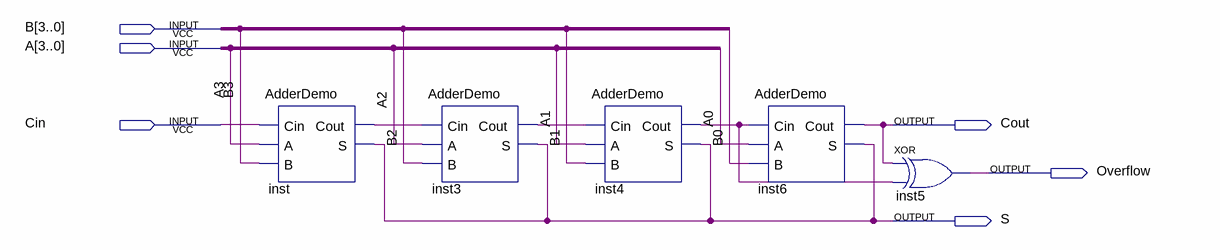
[diagram p0: schematic sheet]
// Quartus schematic Adder.bdf as structural Verilog: 5 symbols, 6 pins
module Adder (
  input  [3:0] B,
  input  [3:0] A,
  input  Cin,
  output Cout,
  output Overflow,
  output S
);

  wire inst3_cout, inst4_cout, inst_cout;

  AdderDemo inst (.Cin(Cin), .A(A[3]), .B(B[3]), .Cout(inst_cout), .S(S));
  AdderDemo inst3 (.Cin(inst_cout), .A(A[2]), .B(B[2]), .Cout(inst3_cout), .S(S));
  AdderDemo inst4 (.Cin(inst3_cout), .A(A[1]), .B(B[1]), .Cout(inst4_cout), .S(S));
  AdderDemo inst6 (.Cin(inst4_cout), .A(A[0]), .B(B[0]), .Cout(Cout), .S(S));
  xor inst5 (Overflow, Cout, inst4_cout);
endmodule
